# Altium schematic sheet VREG_RS485_XS.SchDoc: ESU - VREG/RS485
size B; DrawnBy: M. Seago; Organization: Gravitas; Address1: Sponsored By:; Address2: Alan Morgan; Address3: Technical Advisor:; Address4: Dr. Joseph Morgan; Revision: 1A; SheetNumber: 3; SheetTotal: 3
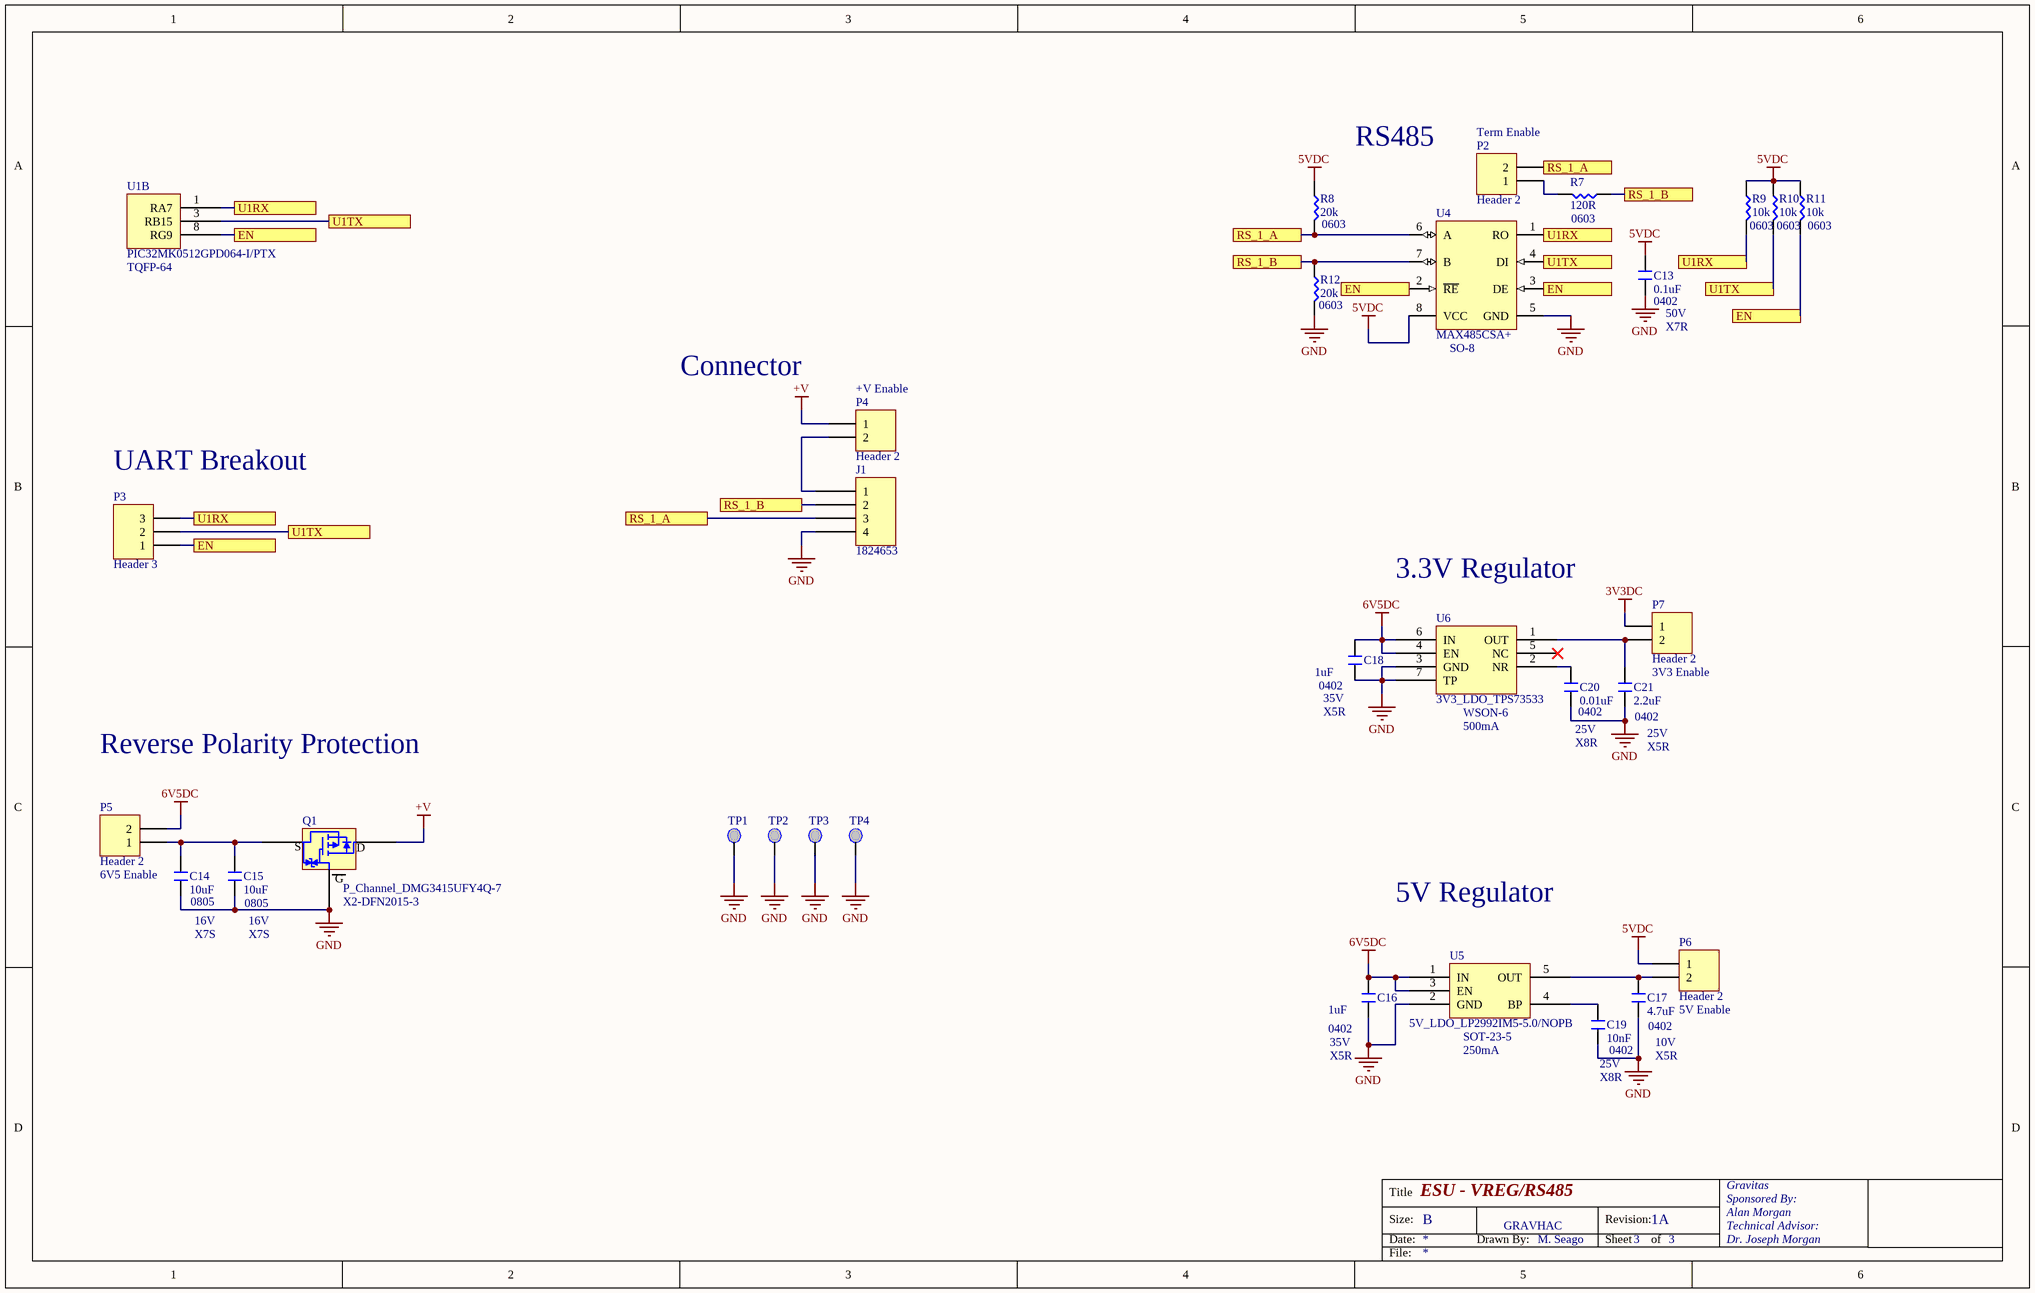
[diagram p0: VREG_RS485_XS.SchDoc]

## Parts
C13  0.1uF  [NonPolar-0402]
C14  10uF  [NonPolar-0805]
C15  10uF  [NonPolar-0805]
C16  1uF  [NonPolar-0402]
C17  4.7uF  [NonPolar-0402]
C18  1uF  [NonPolar-0402]
C19  10nF  [NonPolar-0402]
C20  0.01uF  [NonPolar-0402]
C21  2.2uF  [NonPolar-0402]
J1  1824653  [1824653]
P2  Header 2  [HDR1X2]
P3  Header 3  [HDR1X3]
P4  Header 2  [HDR1X2]
P5  Header 2  [HDR1X2]
P6  Header 2  [HDR1X2]
P7  Header 2  [HDR1X2]
Q1  P_Channel_DMG3415UFY4Q-7  [P_Channel_DMG3415UFY4Q-7_attempt1]
R7  120R  [NonPolar-0603]
R8  20k  [NonPolar-0603]
R9  10k  [NonPolar-0603]
R10  10k  [NonPolar-0603]
R11  10k  [NonPolar-0603]
R12  20k  [NonPolar-0603]
TP1  TestPoint  [TP - S2751-46R]  (value not drawn)
TP2  TestPoint  [TP - S2751-46R]  (value not drawn)
TP3  TestPoint  [TP - S2751-46R]  (value not drawn)
TP4  TestPoint  [TP - S2751-46R]  (value not drawn)
U1  PIC32MK0512GPD064-I/PTX  [PIC32MK0512GPD064]  (part B of 3)
U4  MAX485CSA+  [MAXM-MAX485CSA+-8_M]
U5  5V_LDO_LP2992IM5-5.0/NOPB  [LP2992IM5-5.0/NOPB]
U6  3V3_LDO_TPS73533  [TPS73533DRVT]

## Ports
EN, RS_1_A, RS_1_B, U1RX, U1TX

## Nets
3V3DC: P7.1
5VDC: C13.2 P6.1 R8.2 R9.2 R10.2 R11.2 U4.8(VCC)
6V5DC: C16.2 C18.2 P5.2 U5.1(IN) U5.3(EN) U6.4(EN) U6.6(IN)
+V: P4.1 Q1.3
GND: C13.1 C14.1 C15.1 C16.1 C17.1 C18.1 C19.1 C20.1 C21.1 J1.4 Q1.1 R12.1 TP1.1 TP2.1 TP3.1 TP4.1 U4.5(GND) U5.2(GND) U6.3(GND) U6.7(TP)
EN: P3.1 R11.1 U1.8(RG9) U4.2(~{RE}) U4.3(DE) ; port EN
RS_1_A: J1.3 P2.2 R8.1 U4.6(A) ; port RS_1_A
RS_1_B: J1.2 R7.2 R12.2 U4.7(B) ; port RS_1_B
U1RX: P3.3 R9.1 U1.1(RA7) U4.1(RO) ; port U1RX
U1TX: P3.2 R10.1 U1.3(RB15) U4.4(DI) ; port U1TX
NetC14_2: C14.2 C15.2 P5.1 Q1.2
NetC17_2: C17.2 P6.2 U5.5(OUT)
NetC19_2: C19.2 U5.4(BP)
NetC20_2: C20.2 U6.2(NR)
NetC21_2: C21.2 P7.2 U6.1(OUT)
NetJ1_1: J1.1 P4.2
NetP2_1: P2.1 R7.1

Not connected (* = marked no-connect by the designer): U6 5(NC)*

## Notes on the sheet
- RS485
- (near P2) Term Enable
- (near R8) 0603
- (near R7) 0603
- 0603
- (near R11) 0603
- (near U1) TQFP-64
- (near R12) 0603
- (near U4) SO-8
- (near C13) 0402
- (near C13) 50V
- (near C13) X7R
- Connector
- (near P4) +V Enable
- (near P3) UART Breakout
- 3.3V Regulator
- (near C18) 0402
- (near C18) 35V
- 3V3 Enable
- Reverse Polarity Protection
- (near C18) X5R
- (near U6) WSON-6
- (near U6) 500mA
- 25V
- X8R
- 0402
- (near C21) 0402
- (near C21) 25V
- X5R
- 6V5 Enable
- 0805
- (near C15) 0805
- (near Q1) X2-DFN2015-3
- 5V Regulator
- 16V
- X7S
- (near C16) 0402
- (near C16) 35V
- (near U5) SOT-23-5
- (near C17) 0402
- 10V
- 5V Enable
- (near C16) X5R
- (near U5) 250mA
- (near C19) 25V
- (near C19) X8R
- (near C19) 0402
- GRAVHAC
- Title
- Size:
- Date:
- B
- Drawn By:
- Revision:
- Sheet
- of
- File:
- (in symbol P_Channel_DMG3415UFY4Q-7) S; D; G

## Library data of the parts
C13 C16-C21 = Cap - 0402
C14 C15 = Cap - 0805
P2 P4-P7 = Header 2: Header, 2-Pin; LatestRevisionDate: 17-Jul-2002; LatestRevisionNote: Re-released for DXP Platform.; Publisher: Altium Limited
P3 = Header 3: Header, 3-Pin; LatestRevisionDate: 17-Jul-2002; LatestRevisionNote: Re-released for DXP Platform.; Publisher: Altium Limited
R7-R12 = Res - 0603
TP1-TP4 = TestPoint: S2751-46R
U4 = CMP-2000-05211-1: Low-Power, Slew-Rate-Limited RS-485/RS-422 Transceiver, 4.75 to 5.25 V, 0 to 70 degC, 8-Pin SOIC, RoHS, Tape and Reel; Manufacturer: Maxim; No. of Receivers: 1; Transceiver Type: Differential; Supply Voltage Min: 4.75V; IC Generic Number: 485; IC Temperature Range: Commercial; No. of Pins: 8; Supply Voltage Range: 4.75Vto5.25V; Interface: RS-422/RS-485; Supply Voltage Max: 5.25V; Data Rate: 2.5Mbps; Line / Bus Driver / Receiver / Transceiver Type: CMOSDifferential; Supply Current: 500µA; Interface Type: RS422,RS485; Device Type: Transceiver; Manufacturer URL: http://www.maximintegrated.com/; Operating Temperature Range: 0degCto+70degC; Package / Case: SOIC; Digital IC Case Style: SOIC; Operating Temperature Max: 70degC; Device Marking: MAX485CSA+; Driver Case Style: SOIC; Datasheet Version: Rev. 8, 10/2003; Operating Temperature Min: 0degC; Datasheet URL: https://datasheet.ciiva.com/29306/170071-da-01-en-ic-max485csa-so8-29306144.pdf; Base Number: 485; No. of Drivers: 1; Logic Function Number: 485